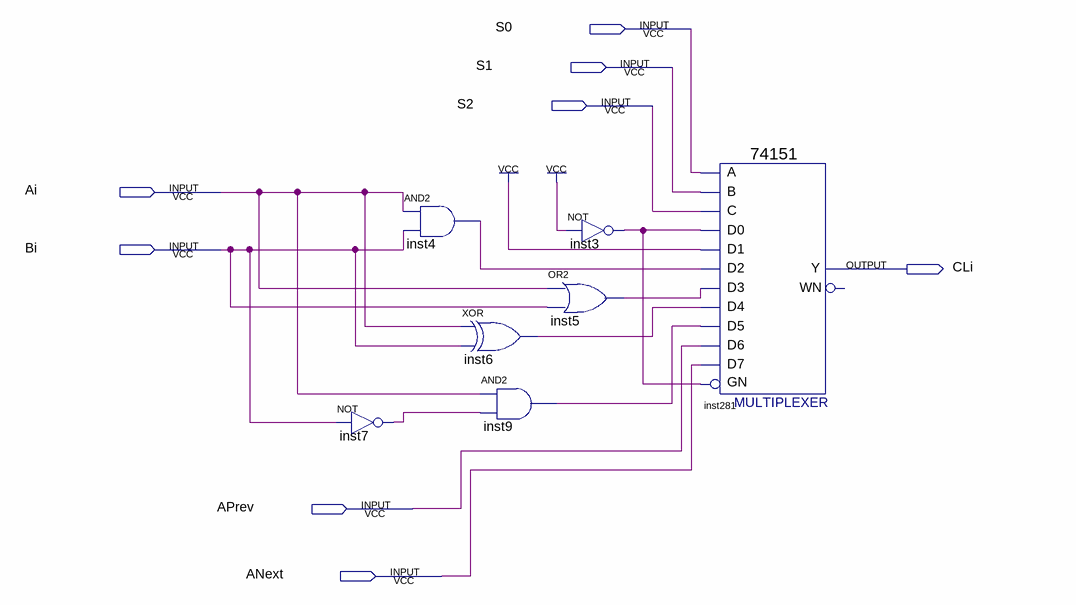
[diagram p0: schematic sheet]
// Quartus schematic logiccircuit1bit.bdf as structural Verilog: 7 symbols, 8 pins
module logiccircuit1bit (
  input  S0,
  input  S1,
  input  S2,
  input  Ai,
  input  Bi,
  input  APrev,
  input  ANext,
  output CLi
);

  wire inst3_out, inst4_out, inst5_out, inst6_out, inst7_out, inst9_out;

  not inst7 (inst7_out, Bi);
  and inst4 (inst4_out, Ai, Bi);
  xor inst6 (inst6_out, Ai, Bi);
  and inst9 (inst9_out, Ai, inst7_out);
  not inst3 (inst3_out, 1'b1);
  or inst5 (inst5_out, Ai, Bi);
  \74151  inst281 (
    .GN(inst3_out), .C(S2), .B(S1), .A(S0), .D5(inst9_out), .D0(inst3_out), .D1(1'b1), .D4(inst6_out),
    .D3(inst5_out), .D2(inst4_out), .D6(APrev), .D7(ANext), .Y(CLi));  // open: WN
endmodule
